# Altium schematic sheet USB TO TTL.SchDoc
size A4
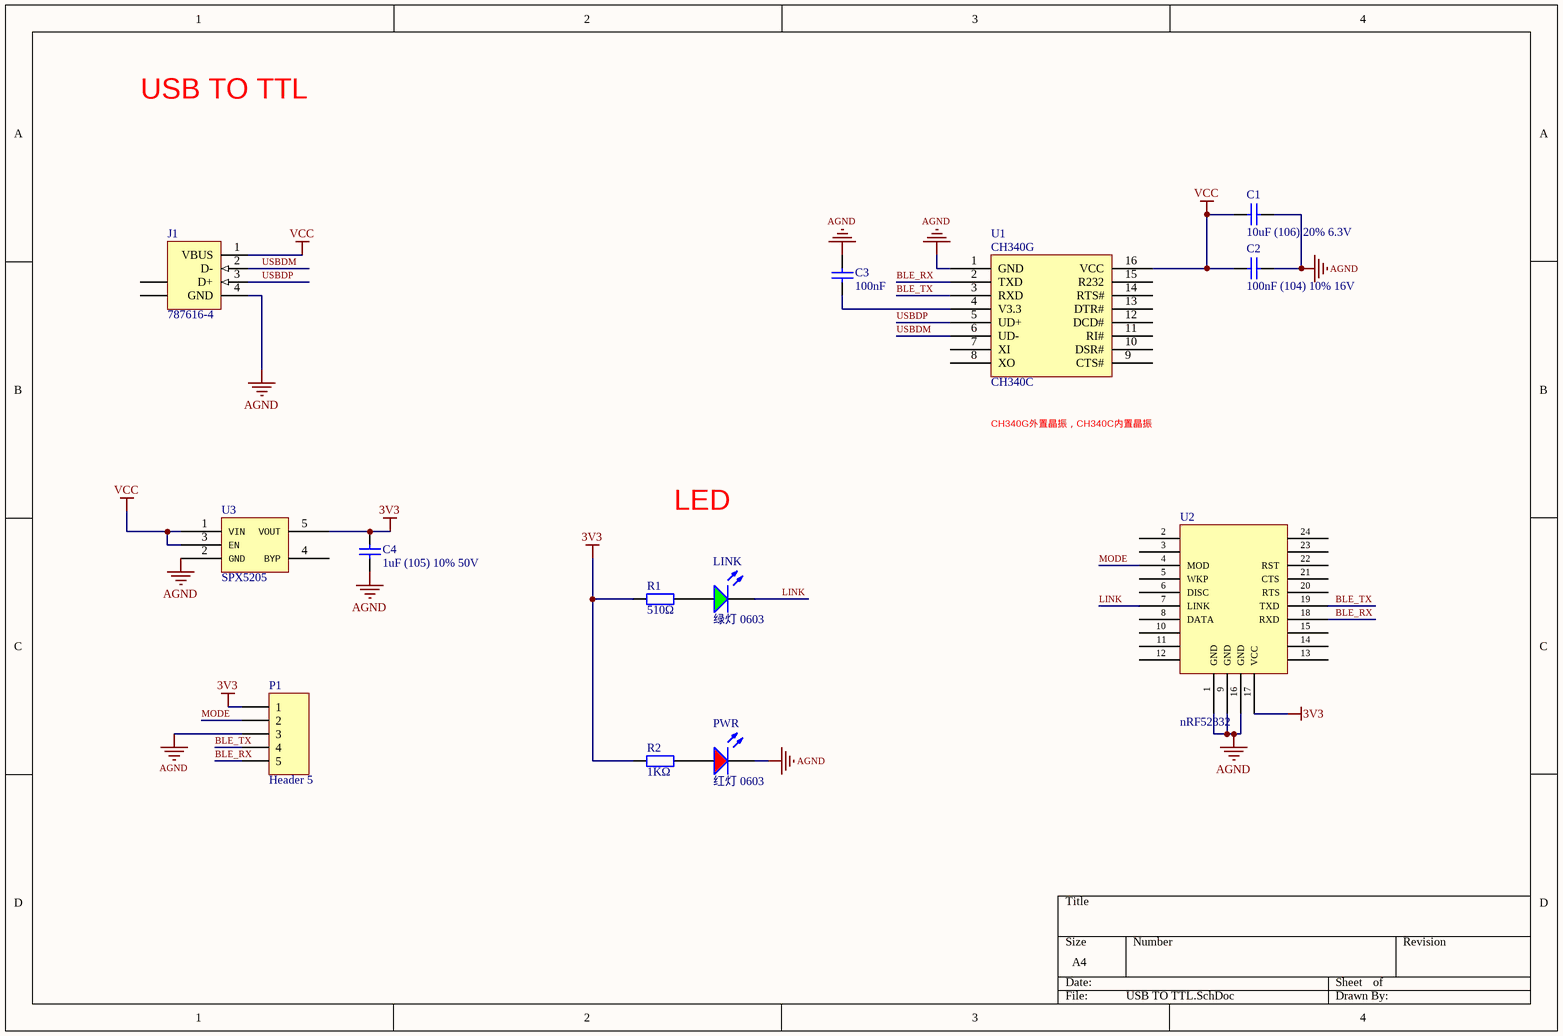
[diagram p0: USB TO TTL.SchDoc]

## Parts
C1  10uF (106) 20% 6.3V  [0603_C]
C2  100nF (104) 10% 16V  [0603_C]
C3  100nF  [0603_C]
C4  1uF (105) 10% 50V  [0603_C]
J1  787616-4  [USB-A直插公头]
LINK  绿灯 0603  [0603_LED_S1]
P1  Header 5  [HDR1X5]
PWR  红灯 0603  [0603_LED_S1]
R1  510Ω  [0603_R]
R2  1KΩ  [0603_R]
U1  CH340C  [SOIC-16_150mil]
U2  nRF52832  [nRF52832]
U3  SPX5205  [SOT-23-5]

## Nets
3V3: C4.2 P1.1 R1.1 R2.1 U2.17(VCC) U3.5(VOUT)
AGND: C1.2 C2.2 C3.2 C4.1 J1.4(GND) P1.3 PWR.K U1.1(GND) U2.1(GND) U2.9(GND) U2.16(GND) U3.2(GND)
VCC: C1.1 C2.1 J1.1(VBUS) U1.16(VCC) U3.1(VIN) U3.3(EN)
BLE_RX: P1.5 U1.2(TXD) U2.18(RXD)
BLE_TX: P1.4 U1.3(RXD) U2.19(TXD)
LINK: LINK.K U2.7(LINK)
MODE: P1.2 U2.4(MOD)
USBDM: J1.2(D-) U1.6(UD-)
USBDP: J1.3(D+) U1.5(UD+)
NetC3_1: C3.1 U1.4(V3.3)
NetLINK_A: LINK.A R1.2
NetPWR_A: PWR.A R2.2

Not connected (* = marked no-connect by the designer): J1 5(SHLD) 6(SHLD); U1 7(XI) 8(XO) 9(CTS#) 10(DSR#) 11(RI#) 12(DCD#) 13(DTR#) 14(RTS#) 15(R232); U2 2 3 5(WKP) 6(DISC) 8(DATA) 10 11 12 13 14 15 20(RTS) 21(CTS) 22(RST) 23 24; U3 4(BYP)

## Notes on the sheet
- USB TO TTL
- CH340G外置晶振，CH340C内置晶振
- LED
- (in symbol CH340G_[C14267]) CH340G

## Library data of the parts
C1 = 0402 10uF (106) 20% 6.3V: 贴片电容; ComponentLink1Description: 供应商链接; ComponentLink1URL: http://www.szlcsc.com/product/details_16204.html; Package: 0402; Supplier: LC; SuppliersPartNumber: C15525
C2 C3 = 0402 100nF (104) 10% 16V: 贴片电容; ComponentLink1Description: 供应商链接; ComponentLink1URL: http://www.szlcsc.com/product/details_1877.html; Package: 0402; Supplier: LC; SuppliersPartNumber: C1525
C4 = 0603 1uF (105) 10% 50V: 贴片电容; ComponentLink1Description: 供应商链接; ComponentLink1URL: http://www.szlcsc.com/product/details_16531.html; Package: 0603; Supplier: LC; SuppliersPartNumber: C15849
J1 = 787616-4: USB 1.1, Right Angle, Thru-Hole, A Type, Receptacle, 4 Position, Black; ContactMaterial: Copper Alloy; ContactPlating: Gold Flash over Palladium Nickel or Gold (30) over Nickel; TerminationLength: 2.84mm [0.112in.]; PCB_Layout: Complies with manufacturer's recommendation.; DrillSize: Corresponds to nominal value.; PanelGround: Without; Published: 15-Jul-2004; DatasheetDocument: 11-Jan-2004; PackageDocument: 11-Jan-2004; PackageReference: 787616; Publisher: Altium Limited; HousingMaterial: Thermoplastic; ComponentLink1Description: Manufacturer Link; ComponentLink1URL: http://www.tycoelectronics.com/; ComponentLink2Description: Packaging Specification; ComponentLink2URL: http://ecommas.tycoelectronics.com/commerce/DocumentDelivery/DDEController?Action=showdoc&DocId=Customer+Drawing%7F787616%7FK%7Fpdf%7FEnglish%7FENG_CD_787616_K.pdf
LINK = 0603 绿灯: 发光二极管; ComponentLink1Description: 供应商链接; ComponentLink1URL: http://www.szlcsc.com/product/details_73152.html; Package: 0603; Supplier: LC; SuppliersPartNumber: C72043
P1 = Header 5: Header, 5-Pin; LatestRevisionDate: 17-Jul-2002; LatestRevisionNote: Re-released for DXP Platform.; Publisher: Altium Limited
PWR = 0603 红灯: 发光二极管; ComponentLink1Description: 供应商链接; ComponentLink1URL: http://www.szlcsc.com/product/details_2659.html; Package: 0603; Supplier: LC; SuppliersPartNumber: C2286
R1 = 0603 510Ω (5100) 1%: 贴片电阻; ComponentLink1Description: 供应商链接; ComponentLink1URL: http://www.szlcsc.com/product/details_23920.html; Package: 0603; Supplier: LC; SuppliersPartNumber: C23193
R2 = 0603 1KΩ (1001) 1%: 贴片电阻; ComponentLink1Description: 供应商链接; ComponentLink1URL: http://www.szlcsc.com/product/details_21904.html; Package: 0603; Supplier: LC; SuppliersPartNumber: C21190
U1 = CH340G_[C14267]: USB; ComponentLink1Description: 供应商链接; ComponentLink1URL: http://www.szlcsc.com/product/details_14927.html; Package: SOIC-16_150mil; Supplier: LC; SuppliersPartNumber: C14267